# EAGLE board FSAE Dash v0.2 (EAGLE 7.7.0)
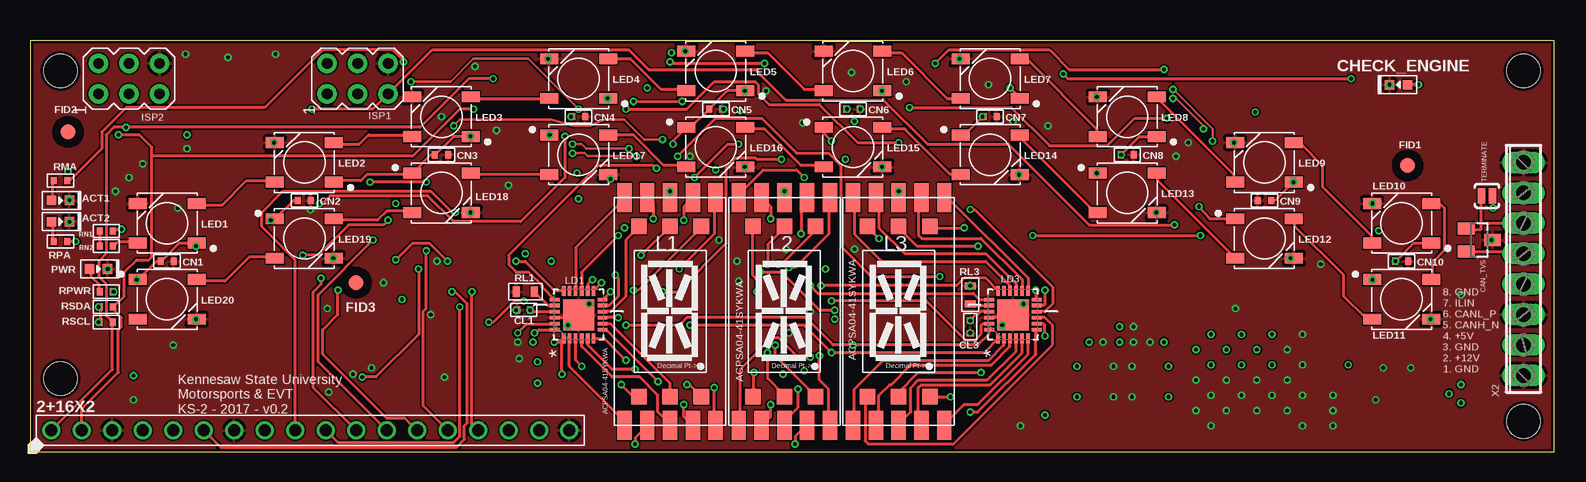
[diagram p5: board, top side]
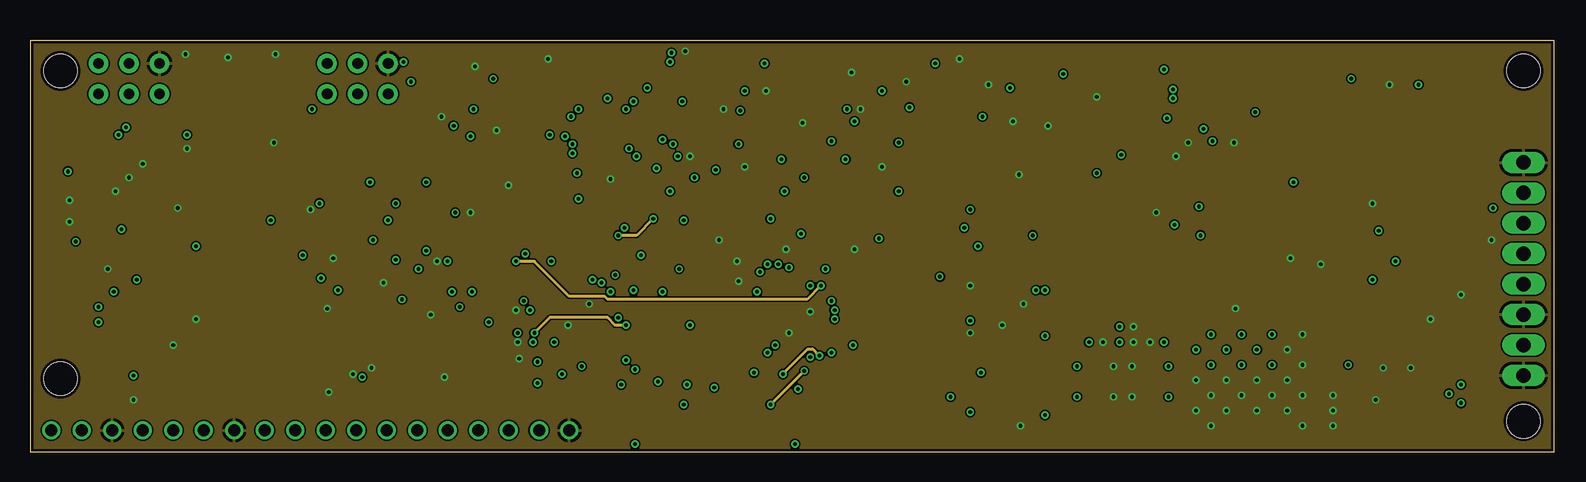
[diagram p6: board, inner layer Route2]
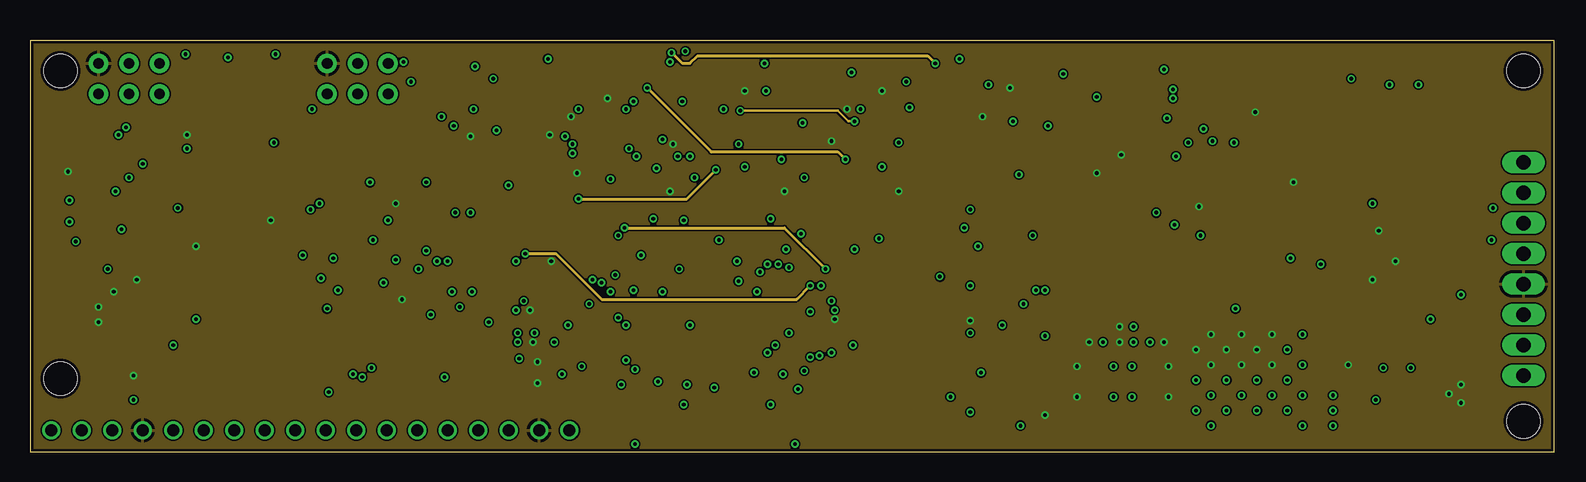
[diagram p7: board, inner layer Route15]
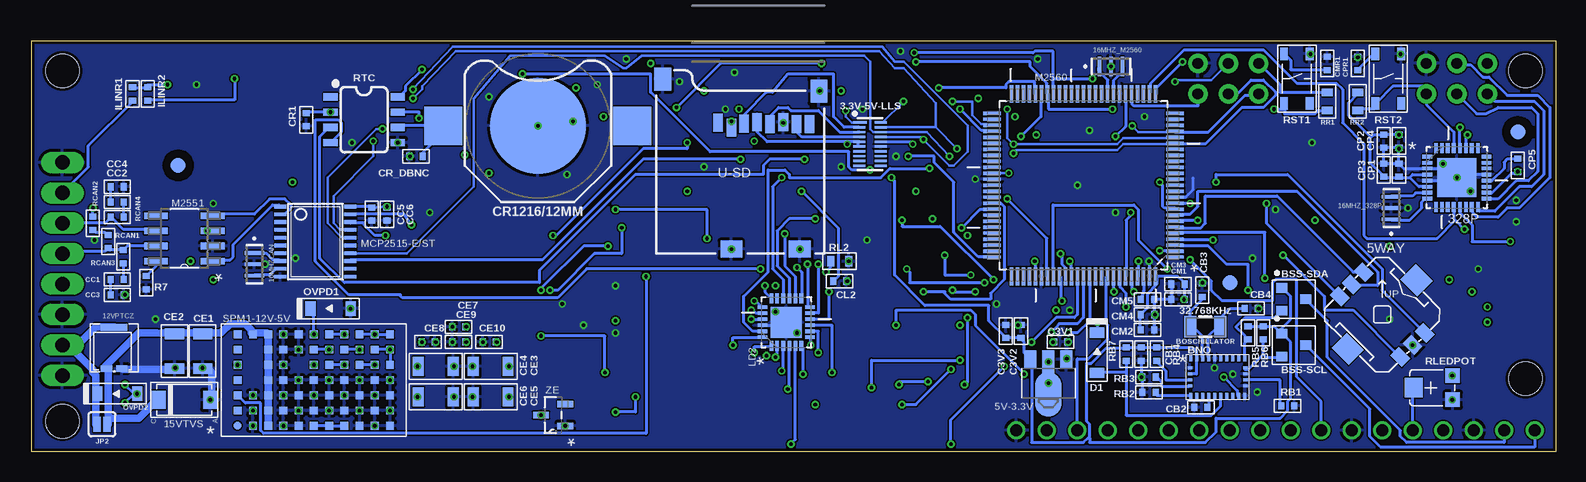
[diagram p8: board, bottom side, seen from below]

Size 127 x 34.29 mm. Coordinates in mm from the lower left corner, seen from the top.
Outline: 0,0 127,0 127,34.29 0,34.28 0,0
Copper layers (1*2*15*16): Top 0.035mm / dielectric 0.23mm / Route2 0.035mm / dielectric 0.93mm / Route15 0.035mm / dielectric 0.23mm / Bottom 0.035mm
Design rules "MF_Standard_4_Layer": minimum track width 5mil, minimum drill 12mil, track to track 5mil, track to pad 5mil, pad to pad 5mil, via to via 5mil, smd to smd 0mil, copper to edge 10mil, drill to drill 10mil, minimum pad ring 6mil, minimum via ring 6mil, stop-mask expansion 2mil, vias tented up to drill 25mil, thermal gap 10mil
Net classes: 0 default: width 0.254 mm, drill 0.305 mm, clearance 0.064 mm; 1 _12mil: width 0.305 mm, clearance 0.127 mm; 2 _25mil: width 0.635 mm, clearance 0.127 mm; 3 5mil: width 0.127 mm, clearance 0.127 mm; 4 10mil: width 0.254 mm, clearance 0.254 mm; 5 8mil: width 0.203 mm, drill 0.305 mm, clearance 0.064 mm
Holes 2.8 mm at 2.54,31.75 124.46,2.54 124.46,31.75 2.54,6.1

## Footprints (pad centres in the part's own frame; a part is rotated, then mirrored left to right if it is on the bottom)
PTH_2.54MM_01X18 = drill 1: P$1 -21.59,0; P$2 -19.05,0; P$3 -16.51,0; P$4 -13.97,0; P$5 -11.43,0; P$6 -8.89,0; P$7 -6.35,0; P$8 -3.81,0; P$9 -1.27,0; P$10 1.27,0; P$11 3.81,0; P$12 6.35,0; P$13 8.89,0; P$14 11.43,0; P$15 13.97,0; P$16 16.51,0; P$17 19.05,0; P$18 21.59,0
UFDFN-20 = smd 0.2 x 1.1: 1 -1.8,-0.85 | smd 0.2 x 1: 2 -1.4,-0.9; 3 -1,-0.9; 4 -0.6,-0.9; 5 -0.2,-0.9; 6 0.2,-0.9; 7 0.6,-0.9; 8 1,-0.9; 9 1.4,-0.9; 10 1.8,-0.9; 11 1.8,0.9; 12 1.4,0.9; 13 1,0.9; 14 0.6,0.9; 15 0.2,0.9; 16 -0.2,0.9; 17 -0.6,0.9; 18 -1,0.9; 19 -1.4,0.9; 20 -1.8,0.9
SOT89 = smd 1 x 1.5: 1 -1.499,-1.981; 3 1.499,-1.981 | smd 1 x 2: 2 0,-1.727 | smd 2.2 x 3.7: 2@1 0,0.94
ALPS-SKRHAAE010 = smd 1.35 x 1: P6D-D 3.575,-1.425; PA1-U -3.575,1.425; PB4-R 3.575,1.425; PC3-L -3.575,-1.425; PCEN2 -3.575,0; PCOM5 3.575,0 | smd 2 x 1.8: P7U 0,-4.05; P8U 0,4.05
LITTELFUSE-POLYZEN-ZEN164V130A24LS = smd 0.56 x 2.21: P1VIN -1.72,0 | smd 0.56 x 0.94: P2GND 1.72,0.635; P3VOUT 1.72,-0.635
LITTELFUSE-TPSMA6L15A = smd 1.2 x 1.52: PA 2.16,0; PC -2.16,0
OSC_CSTCE16M0V53-R0 = smd 0.3 x 1.6: 1 -0.95,0; 2 0,0; 3 0.95,0
QFN50P500X500X100-33N = smd 0.813 x 0.305: 1 -2.464,1.753; 2 -2.464,1.245; 3 -2.464,0.762; 4 -2.464,0.254; 5 -2.464,-0.254; 6 -2.464,-0.762; 7 -2.464,-1.245; 8 -2.464,-1.753; 17 2.464,-1.753; 18 2.464,-1.245; 19 2.464,-0.762; 20 2.464,-0.254; 21 2.464,0.254; 22 2.464,0.762; 23 2.464,1.245; 24 2.464,1.753 | smd 0.305 x 0.813: 9 -1.753,-2.464; 10 -1.245,-2.464; 11 -0.762,-2.464; 12 -0.254,-2.464; 13 0.254,-2.464; 14 0.762,-2.464; 15 1.245,-2.464; 16 1.753,-2.464; 25 1.753,2.464; 26 1.245,2.464; 27 0.762,2.464; 28 0.254,2.464; 29 -0.254,2.464; 30 -0.762,2.464; 31 -1.245,2.464; 32 -1.753,2.464 | smd 3.251 x 3.251: 33 0,0
LED0603 = smd 0.8 x 0.8: ANODE 0.75,0; CATHODE -0.75,0
BOSCH-BNO055 = smd 0.25 x 0.475: P1 -2.25,1.562; P6 -2.25,-1.562; P7 -1.75,-1.562; P8 -1.25,-1.562; P9 -0.75,-1.562; P10 -0.25,-1.562; P11 0.25,-1.562; P12 0.75,-1.562; P13 1.25,-1.562; P14 1.75,-1.562; P15 2.25,-1.562; P20 2.25,1.562; P21 1.75,1.562; P22 1.25,1.562; P23 0.75,1.562; P24 0.25,1.562; P25 -0.25,1.562; P26 -0.75,1.562; P27 -1.25,1.562; P28 -1.75,1.562 | smd 0.375 x 0.25: P2 -2.312,0.75; P3 -2.312,0.25; P4 -2.312,-0.25; P5 -2.312,-0.75; P16 2.312,-0.75; P17 2.312,-0.25; P18 2.312,0.25; P19 2.312,0.75
CRYSTAL-SMD-3.2X1.5MM = smd 1 x 1.8: P$1 -1.25,0; P$2 1.25,0
SOT-23-3 = smd 0.9 x 0.8: P$1 -1,0.95; P$2 -1,-0.95; P$3 1,0
C0402 = smd 0.5 x 0.6: P$1 -0.55,0; P$2 0.55,0
SOT23 = smd 1 x 1.4: 1 -0.95,-1.1; 2 0.95,-1.1; 3 0,1.1
C1206 = smd 0.9 x 1.6: P$1 -1.45,0; P$2 1.45,0
BATTCON_12MM = smd 8 x 8: GND 0,0 | smd 3.175 x 3.175: PWR@1 -7.874,0; PWR@2 7.874,0
SOD-123 = smd 0.85 x 1.2: ANODE 1.675,0; CATHODE -1.675,0
FIDUCIAL_100MIL = smd 1.27 x 1.27: P$1 0,0 | smd 1.27 x 1.27 bottom: P$2 0,0
R0402 = smd 0.5 x 0.6: P$1 -0.55,0; P$2 0.55,0
AVRISP = drill 0.9 pad 1.626: 1 -1.27,2.54; 2 1.27,2.54; 3 -1.27,0; 4 1.27,0; 5 -1.27,-2.54; 6 1.27,-2.54
SMT-JUMPER_2_NO_SILK = smd 0.635 x 1.27: 1 -0.406,0; 2 0.406,0
ACPSA04-41SYKWA = smd 1.2 x 2.4: P$1 -3.8,-9.5; P$2 -1.9,-9.5; P$3 0,-9.5; P$4 1.9,-9.5; P$5 3.8,-9.5; P$12 3.8,9.5; P$13 1.9,9.5; P$14 0,9.5; P$15 -1.9,9.5; P$16 -3.8,9.5 | smd 1.3 x 1.3: P$6 2.6,-7.1; P$7 0,-7.1; P$8 -2.6,-7.1; P$9 -2.6,7.1; P$10 0,7.1; P$11 2.6,7.1
QFN50P400X400X100-25N = smd 0.813 x 0.305: 1 -1.981,1.245; 2 -1.981,0.762; 3 -1.981,0.254; 4 -1.981,-0.254; 5 -1.981,-0.762; 6 -1.981,-1.245; 13 1.981,-1.245; 14 1.981,-0.762; 15 1.981,-0.254; 16 1.981,0.254; 17 1.981,0.762; 18 1.981,1.245 | smd 0.305 x 0.813: 7 -1.245,-1.981; 8 -0.762,-1.981; 9 -0.254,-1.981; 10 0.254,-1.981; 11 0.762,-1.981; 12 1.245,-1.981; 19 1.245,1.981; 20 0.762,1.981; 21 0.254,1.981; 22 -0.254,1.981; 23 -0.762,1.981; 24 -1.245,1.981 | smd 2.591 x 2.591: 25 -0.025,0
WS2812B = smd 1.5 x 0.9: P$1 -2.45,1.65; P$2 -2.45,-1.65; P$3 2.45,-1.65; P$4 2.45,1.65
TSSOP20 = smd 0.305 x 0.991: 1 -2.925,-2.918; 2 -2.275,-2.918; 3 -1.625,-2.918; 4 -0.975,-2.918; 5 -0.325,-2.918; 6 0.325,-2.918; 7 0.975,-2.918; 8 1.625,-2.918; 9 2.275,-2.918; 10 2.925,-2.918; 11 2.925,2.918; 12 2.275,2.918; 13 1.625,2.918; 14 0.975,2.918; 15 0.325,2.918; 16 -0.325,2.918; 17 -0.975,2.918; 18 -1.625,2.918; 19 -2.275,2.918; 20 -2.925,2.918
SOIC127P600X175-8N = smd 1.981 x 0.559: 1 -2.362,1.905; 2 -2.362,0.635; 3 -2.362,-0.635; 4 -2.362,-1.905; 5 2.362,-1.905; 6 2.362,-0.635; 7 2.362,0.635; 8 2.362,1.905
QFP50P1600X1600X120-100N = smd 1.473 x 0.279: 1 -7.62,5.994; 2 -7.62,5.512; 3 -7.62,5.004; 4 -7.62,4.496; 5 -7.62,3.988; 6 -7.62,3.505; 7 -7.62,2.997; 8 -7.62,2.489; 9 -7.62,2.007; 10 -7.62,1.499; 11 -7.62,0.991; 12 -7.62,0.508; 13 -7.62,0; 14 -7.62,-0.508; 15 -7.62,-0.991; 16 -7.62,-1.499; 17 -7.62,-2.007; 18 -7.62,-2.489; 19 -7.62,-2.997; 20 -7.62,-3.505; 21 -7.62,-3.988; 22 -7.62,-4.496; 23 -7.62,-5.004; 24 -7.62,-5.512; 25 -7.62,-5.994; 51 7.62,-5.994; 52 7.62,-5.512; 53 7.62,-5.004; 54 7.62,-4.496; 55 7.62,-3.988; 56 7.62,-3.505; 57 7.62,-2.997; 58 7.62,-2.489; 59 7.62,-2.007; 60 7.62,-1.499; 61 7.62,-0.991; 62 7.62,-0.508; 63 7.62,0; 64 7.62,0.508; 65 7.62,0.991; 66 7.62,1.499; 67 7.62,2.007; 68 7.62,2.489; 69 7.62,2.997; 70 7.62,3.505; 71 7.62,3.988; 72 7.62,4.496; 73 7.62,5.004; 74 7.62,5.512; 75 7.62,5.994 | smd 0.279 x 1.473: 26 -5.994,-7.62; 27 -5.512,-7.62; 28 -5.004,-7.62; 29 -4.496,-7.62; 30 -3.988,-7.62; 31 -3.505,-7.62; 32 -2.997,-7.62; 33 -2.489,-7.62; 34 -2.007,-7.62; 35 -1.499,-7.62; 36 -0.991,-7.62; 37 -0.508,-7.62; 38 0,-7.62; 39 0.508,-7.62; 40 0.991,-7.62; 41 1.499,-7.62; 42 2.007,-7.62; 43 2.489,-7.62; 44 2.997,-7.62; 45 3.505,-7.62; 46 3.988,-7.62; 47 4.496,-7.62; 48 5.004,-7.62; 49 5.512,-7.62; 50 5.994,-7.62; 76 5.994,7.62; 77 5.512,7.62; 78 5.004,7.62; 79 4.496,7.62; 80 3.988,7.62; 81 3.505,7.62; 82 2.997,7.62; 83 2.489,7.62; 84 2.007,7.62; 85 1.499,7.62; 86 0.991,7.62; 87 0.508,7.62; 88 0,7.62; 89 -0.508,7.62; 90 -0.991,7.62; 91 -1.499,7.62; 92 -2.007,7.62; 93 -2.489,7.62; 94 -2.997,7.62; 95 -3.505,7.62; 96 -3.988,7.62; 97 -4.496,7.62; 98 -5.004,7.62; 99 -5.512,7.62; 100 -5.994,7.62
R0603 = smd 0.6 x 0.9: P$1 -0.75,0; P$2 0.75,0
TC33 = smd 1.2 x 1.2: P$1 -1.8,1; P$3 -1.8,-1 | smd 1.5 x 1.6: P$2 1.45,0
TACT4.2MM = smd 1.05 x 0.65: P$1 -2.075,1.075; P$2 2.075,1.075; P$3 -2.075,-1.075; P$4 2.075,-1.075
SO08 = smd 0.6 x 1.2: 1 -1.905,-2.8; 2 -0.635,-2.8; 3 0.635,-2.8; 4 1.905,-2.8; 5 1.905,2.8; 6 0.635,2.8; 7 -0.635,2.8; 8 -1.905,2.8
SPM1004-5V0C = smd 0.65 x 0.65: AGND$1 -5.08,-1.27; AGND$2 -5.08,-2.54; AGND$3 -5.08,-3.81; EN -6.35,3.81; PGND$1 -2.54,3.81; PGND$2 -1.27,3.81; PGND$3 -2.54,2.54; PGND$4 -1.27,2.54; PGND$5 -2.54,1.27; PGND$6 -2.54,0; PGND$7 -1.27,0; PGND$8 0,0; PGND$9 1.27,0; PGND$10 2.54,0; PGND$11 3.81,0; PGND$12 5.08,0; PGND$13 6.35,0; PGND$14 -2.54,-1.27; PGND$15 -1.27,-1.27; PGND$16 0,-1.27; PGND$17 1.27,-1.27; PGND$18 2.54,-1.27; PGND$19 3.81,-1.27; PGND$20 5.08,-1.27; PGND$21 6.35,-1.27; PGND$22 -2.54,-2.54; PGND$23 -1.27,-2.54; PGND$24 0,-2.54; PGND$25 1.27,-2.54; PGND$26 2.54,-2.54; PGND$27 3.81,-2.54; PGND$28 5.08,-2.54; PGND$29 6.35,-2.54; PGND$30 -2.54,-3.81; PGND$31 -1.27,-3.81; PGND$32 3.81,-3.81; PGND$33 5.08,-3.81; PGND$34 6.35,-3.81; PHASE$1 0,-3.81; PHASE$2 1.27,-3.81; PHASE$3 2.54,-3.81; PVIN$1 -5.08,3.81; PVIN$2 -3.81,3.81; PVIN$3 -3.81,2.54; PVIN$4 -3.81,1.27; PVIN$5 -3.81,0; PVIN$6 -3.81,-1.27; PVIN$7 -3.81,-2.54; PVIN$8 -3.81,-3.81; PWRGD -6.35,-1.27; SS -6.35,0; VADJ -6.35,2.54; VAUX$1 -6.35,-2.54; VAUX$2 -6.35,-3.81; VOUT$1 0,3.81; VOUT$2 1.27,3.81; VOUT$3 2.54,3.81; VOUT$4 3.81,3.81; VOUT$5 5.08,3.81; VOUT$6 6.35,3.81; VOUT$7 0,2.54; VOUT$8 1.27,2.54; VOUT$9 2.54,2.54; VOUT$10 3.81,2.54; VOUT$11 5.08,2.54; VOUT$12 6.35,2.54; VOUT$13 0,1.27; VOUT$14 1.27,1.27; VOUT$15 2.54,1.27; VOUT$16 3.81,1.27; VOUT$17 5.08,1.27; VOUT$18 6.35,1.27; VSENSE -6.35,1.27
PAD-JUMPER-2-NO_YES_SILK = smd 0.635 x 1.27: 1 -0.45,0; 2 0.45,0
MICROSD_1:1 = smd 0.8 x 1.5: 1 5.096,10.919; 2 6.218,10.519; 3 7.274,10.853; 4 8.367,10.982; 5 9.421,10.828; 6 10.539,10.973; 7 11.648,10.819; 8 12.721,10.819 | smd 1.8 x 1.4: CD1 11.92,0.4; CD2 6.22,0.4 | smd 1.4 x 1.9: GND1 0.497,14.55; GND3 13.52,13.55
8POL254 = drill 1.2 long: 1 -8.89,0; 2 -6.35,0; 3 -3.81,0; 4 -1.27,0; 5 1.27,0; 6 3.81,0; 7 6.35,0; 8 8.89,0
SOT91P240X110-3N = smd 1.321 x 0.559: 1 -1.016,0.914; 2 -1.016,-0.914; 3 1.016,0

## Placement (x,y rotation side)
2+16X2  MF-CON-2.54mm-01x18  [PTH_2.54MM_01X18]  23.37,1.78 0 top
3.3V-5V-LLS  TXB0108DQSR  [UFDFN-20]  57.15,25.65 270 bottom
5V-3.3V  MCP1703T-3302E/MB  [SOT89]  42.29,5.71 180 bottom
5WAY  SKRHAAE010  [ALPS-SKRHAAE010]  14.48,11.43 315 bottom
12VPTCZ  ZEN164V130A24LS  [LITTELFUSE-POLYZEN-ZEN164V130A24LS]  120.14,8.64 270 bottom
15VTVS  TPSMA6L15A  [LITTELFUSE-TPSMA6L15A]  114.3,4.32 0 bottom
16MHZ_328P  CSTCE16M0VH3L99-R0  [OSC_CSTCE16M0V53-R0]  13.72,20.32 90 bottom
16MHZ_M2560  CSTCE16M0VH3L99-R0  [OSC_CSTCE16M0V53-R0]  37.08,32.13 0 bottom
16MHZCAN  CSTCE16M0VH3L99-R0  [OSC_CSTCE16M0V53-R0]  108.46,15.62 270 bottom
328P  ATMEGA328P-MU  [QFN50P500X500X100-33N]  8.26,22.86 0 bottom
ACT1  MF-LED-0603-RED  [LED0603]  2.54,20.95 180 top
ACT2  MF-LED-0603-RED  [LED0603]  2.54,19.18 180 top
BNO  BNO055  [BOSCH-BNO055]  28.19,6.22 0 bottom
BOSCHILLATOR  32.768KHz  [CRYSTAL-SMD-3.2X1.5MM]  29.21,10.41 180 bottom
BSS-SCL  MF-DSC-SOT233-BSS138  [SOT-23-3]  21.84,8.89 0 bottom
BSS-SDA  MF-DSC-SOT233-BSS138  [SOT-23-3]  21.84,12.7 0 bottom
C3V1  1uF  [C0402]  41.27,9.14 180 bottom
C3V2  0.1uF  [C0402]  44.58,10.03 270 bottom
C3V3  1uF  [C0402]  45.85,10.03 270 bottom
CAN_TVS  PESD1CAN,215  [SOT23]  120.78,17.65 270 top
CB1  0.1uF  [C0402]  34.54,8.13 270 bottom
CB2  0.1uF  [C0402]  29.59,3.68 180 bottom
CB3  22pf  [C0402]  29.46,13.46 90 bottom
CB4  22pf  [C0402]  25.4,11.94 0 bottom
CC1  0.001uF  [C0402]  119.89,14.35 180 bottom
CC2  0.001uF  [C0402]  119.89,20.83 180 bottom
CC3  0.001uF  [C0402]  119.89,13.08 0 bottom
CC4  0.001uF  [C0402]  119.89,22.1 0 bottom
CC5  0.1uF  [C0402]  98.68,19.81 270 bottom
CC6  0.1uF  [C0402]  97.41,19.81 90 bottom
CE1  C3216X5R1E476M160AC  [C1206]  112.78,8.38 270 bottom
CE2  C3216X5R1E476M160AC  [C1206]  115.11,8.38 270 bottom
CE3  C3216X5R1E476M160AC  [C1206]  88.77,7.11 0 bottom
CE4  C3216X5R1E476M160AC  [C1206]  93.34,7.11 180 bottom
CE5  C3216X5R1E476M160AC  [C1206]  88.77,4.57 0 bottom
CE6  C3216X5R1E476M160AC  [C1206]  93.34,4.57 180 bottom
CE7  0.1uF  [C0402]  91.44,10.41 0 bottom
CE8  1uF  [C0402]  93.98,9.14 0 bottom
CE9  1uF  [C0402]  91.44,9.14 180 bottom
CE10  4.7uF  [C0402]  88.9,9.14 180 bottom
CHECK_ENGINE  MF-LED-0603-RED  [LED0603]  114.05,30.61 0 top
CL1  0.1uF  [C0402]  41.15,11.81 0 top
CL2  0.1uF  [C0402]  59.69,14.22 180 bottom
CL3  0.1uF  [C0402]  78.36,10.41 90 top
CM1  1uF  [C0402]  31.5,12.7 180 bottom
CM2  0.1uF  [C0402]  34.04,10.16 0 bottom
CM3  4.7uF  [C0402]  31.5,13.97 180 bottom
CM4  0.001uF  [C0402]  34.04,11.43 0 bottom
CM5  0.1uF  [C0402]  34.04,12.7 180 bottom
CMR1  1uF  [C0402]  19.05,32.38 270 bottom
CN1  0.1uF  [C0402]  11.43,15.88 0 top
CN2  0.1uF  [C0402]  22.86,20.95 0 top
CN3  0.1uF  [C0402]  34.29,24.77 0 top
CN4  0.1uF  [C0402]  45.72,27.94 0 top
CN5  0.1uF  [C0402]  57.15,28.57 0 top
CN6  0.1uF  [C0402]  68.58,28.57 0 top
CN7  0.1uF  [C0402]  80.01,27.94 0 top
CN8  0.1uF  [C0402]  91.44,24.77 0 top
CN9  0.1uF  [C0402]  102.87,20.95 180 top
CN10  0.1uF  [C0402]  114.3,15.88 0 top
CP1  0.001uF  [C0402]  13.08,23.5 270 bottom
CP2  4.7uF  [C0402]  14.35,25.91 90 bottom
CP3  0.1uF  [C0402]  14.35,23.5 270 bottom
CP4  1uF  [C0402]  13.08,25.91 270 bottom
CP5  0.1uF  [C0402]  3.17,23.88 90 bottom
CPR1  1uF  [C0402]  16.51,32.38 270 bottom
CR1  1uF  [C0402]  104.14,27.69 270 bottom
CR1216/12MM  3000TR  [BATTCON_12MM]  84.84,27.18 0 bottom
CR_DBNC  0.001uF  [C0402]  95,24.64 180 bottom
D1  MF-DIO-SOD123-1N4148  [SOD-123]  38.23,8.26 270 bottom
FID1  [FIDUCIAL_100MIL]  114.81,23.88 0 top
FID2  [FIDUCIAL_100MIL]  3.17,26.67 180 top
FID3  [FIDUCIAL_100MIL]  27.18,14.1 0 top
ILINR1  220  [R0402]  118.62,29.84 90 bottom
ILINR2  220  [R0402]  117.35,29.84 270 bottom
ISP1  AVRISP-6  [AVRISP]  27.3,31.11 90 top
ISP2  AVRISP-6  [AVRISP]  8.26,31.11 90 top
JP2  JUMPER-SMT_2_NO_SILK  [SMT-JUMPER_2_NO_SILK]  121.16,2.29 0 bottom
L1  ACPSA04-41SYKWA  [ACPSA04-41SYKWA]  53.34,11.68 0 top
L2  ACPSA04-41SYKWA  [ACPSA04-41SYKWA]  62.87,11.68 0 top
L3  ACPSA04-41SYKWA  [ACPSA04-41SYKWA]  72.39,11.68 0 top
LD1  TLC59281RGER  [QFN50P400X400X100-25N]  45.72,11.43 90 top
LD2  TLC59281RGER  [QFN50P400X400X100-25N]  64.14,10.79 90 bottom
LD3  TLC59281RGER  [QFN50P400X400X100-25N]  81.92,11.43 90 top
LED1  WS2812B  [WS2812B]  11.43,19.05 180 top
LED2  WS2812B  [WS2812B]  22.86,24.13 180 top
LED3  WS2812B  [WS2812B]  34.29,27.94 180 top
LED4  WS2812B  [WS2812B]  45.72,31.11 180 top
LED5  WS2812B  [WS2812B]  57.15,31.75 180 top
LED6  WS2812B  [WS2812B]  68.58,31.75 180 top
LED7  WS2812B  [WS2812B]  80.01,31.11 180 top
LED8  WS2812B  [WS2812B]  91.44,27.94 180 top
LED9  WS2812B  [WS2812B]  102.87,24.13 180 top
LED10  WS2812B  [WS2812B]  114.3,19.05 180 top
LED11  WS2812B  [WS2812B]  114.3,12.7 0 top
LED12  WS2812B  [WS2812B]  102.87,17.78 0 top
LED13  WS2812B  [WS2812B]  91.44,21.59 0 top
LED14  WS2812B  [WS2812B]  80.01,24.77 0 top
LED15  WS2812B  [WS2812B]  68.58,25.4 0 top
LED16  WS2812B  [WS2812B]  57.15,25.4 0 top
LED17  WS2812B  [WS2812B]  45.72,24.77 0 top
LED18  WS2812B  [WS2812B]  34.29,21.59 0 top
LED19  WS2812B  [WS2812B]  22.86,17.78 0 top
LED20  WS2812B  [WS2812B]  11.43,12.7 0 top
M2515  MCP2515-E/ST  [TSSOP20]  103.38,17.53 270 bottom
M2551  MCP2551-I/SN  [SOIC127P600X175-8N]  114.3,17.78 180 bottom
M2560  ATMEGA2560-16AU  [QFP50P1600X1600X120-100N]  39.37,22.23 180 bottom
OVPD1  PMEG3010ER,115  [SOD-123]  102.11,11.94 0 bottom
OVPD2  PMEG3010ER,115  [SOD-123]  119.89,4.83 0 bottom
PWR  MF-LED-0603-GREEN  [LED0603]  5.71,15.24 180 top
R7  4.7K  [R0402]  117.47,14.1 270 bottom
RB1  10K  [R0402]  22.35,3.81 180 bottom
RB2  10K  [R0402]  33.91,4.95 180 bottom
RB3  10K  [R0402]  33.91,6.22 180 bottom
RB4  10K  [R0402]  33.27,8.13 270 bottom
RB5  10K  [R0402]  25.65,9.91 90 bottom
RB6  10K  [R0402]  24.38,9.91 90 bottom
RB7  10K  [R0402]  35.81,8.13 90 bottom
RCAN1  60.4  [R0402]  120.65,17.53 90 bottom
RCAN2  60.4  [R0402]  121.92,19.05 90 bottom
RCAN3  100  [R0402]  119.38,16.26 270 bottom
RCAN4  100  [R0402]  119.89,19.56 0 bottom
RL1  1.69K  [R0603]  41.27,13.34 0 top
RL2  1.69K  [R0603]  59.69,15.88 180 bottom
RL3  1.69K  [R0603]  78.36,13.08 270 top
RLEDPOT  MF-RES-TC33X-10K  [TC33]  10.41,5.33 180 bottom
RMA  220  [R0402]  2.54,22.61 0 top
RN1  220  [R0402]  6.35,18.41 0 top
RN2  220  [R0402]  6.35,17.14 0 top
RPA  220  [R0402]  2.54,17.53 180 top
RPWR  220  [R0402]  6.35,13.34 0 top
RR1  4.7K  [R0603]  19.05,29.21 270 bottom
RR2  4.7K  [R0603]  16.51,29.21 270 bottom
RSCL  4.7K  [R0402]  6.35,10.79 180 top
RSDA  4.7K  [R0402]  6.35,12.06 180 top
RST1  MF-SW-TACT-4.2MM  [TACT4.2MM]  21.59,31.11 270 bottom
RST2  MF-SW-TACT-4.2MM  [TACT4.2MM]  13.97,31.11 270 bottom
RTC  DS3231MZ/V+  [SO08]  99.31,27.69 270 bottom
SPM1-12V-5V  SPM1004-5V0C  [SPM1004-5V0C]  103.5,5.97 0 bottom
TERMINATE  JUMPER-PAD-2-NOYES_SILK  [PAD-JUMPER-2-NO_YES_SILK]  121.41,21.34 0 top
U-SD  MF-MICROSD  [MICROSD_1:1]  74.93,16.51 0 bottom
X2  MPT8  [8POL254]  124.46,15.24 90 top
ZE  BZX84-A5V6,215  [SOT91P240X110-3N]  83.57,3.05 180 bottom

## Tracks (layer width: path | path; a pad name or v marks a point on that pad's centre or on a via)
+3.3V  (via drill 0.3)
  Top 0.254: v59.05,25.65 58.17,25.65 v55.37,22.86
  Bottom 0.254: RB5.P$2 RB6.P$2 23.46,10.46 BSS-SCL.P$1 | 66.56,28.18 U-SD.4 66.55,27.48 66.55,26.67 65.73,25.85 59.05,25.85 | 59.05,25.85 3.3V-5V-LLS.5 58.17,25.78 58.17,25.53 3.3V-5V-LLS.6 | 45.85,9.53 44.58,9.53 C3V2.P$2 44.58,9.4 44.32,9.14 44.32,8.26 43.81,7.75 5V-3.3V.3 43.69,7.62 43.69,0.76 39.37,0.76 38.92,1.21 | v59.05,25.65 59.05,25.85 | v55.37,22.86 55.12,22.61 55.12,14.73 52.58,12.19 47.24,12.19 47.24,10.92 45.85,9.53 | 45.85,9.53 C3V3.P$2 | BSS-SDA.P$1 22.73,13.59 22.1,12.95 22.1,11.05 22.99,10.16 BSS-SCL.P$1 | BNO.P3 30.48,6.48 29.97,6.48 29.97,7.75 BNO.P28 29.97,7.81 29.97,8.38 30.27,8.68 RB4.P$1 CB1.P$1 RB7.P$2 35.81,8.64 37.47,8.64 38.73,7.37 39.12,7.37 39.12,2.54 38.86,2.29 38.86,1.27 38.92,1.21 | BSS-SCL.P$1 22.73,9.78 22.1,9.14 22.1,4.45 22.35,4.19 22.35,3.43 22.99,2.79 28.32,2.79 28.32,1.65 29.21,0.76 38.86,0.76 38.86,1.14 38.92,1.21
+5V  (via drill 0.3)
  Top 0.254: LD3.21 79.25,11.68 78.99,11.43 78.83,11.43 CL3.P$2 v78.36,10.92 | L3.P$14 v72.39,21.72 | L2.P$14 v62.87,21.72 | L1.P$14 v53.34,21.72 | v53.59,25.65 53.59,25.94 LED16.P$1 55.08,27.05 CN5.P$1 58.12,30.1 v59.56,30.1 LED5.P$1 | LED2.P$1 25.4,22.61 27.56,22.61 28.07,23.11 31.75,23.11 LED18.P$1 31.88,23.24 33.4,24.77 CN3.P$1 33.78,24.77 35.31,26.29 v36.7,26.29 LED3.P$1 | RSCL.P$2 v5.71,10.79 5.84,10.79 5.84,12.06 RSDA.P$2 | v6.99,13.34 RPWR.P$2 | 9.02,14.35 10.54,15.88 CN1.P$1 10.92,15.88 12.45,17.4 13.84,17.4 LED1.P$1 | CL1.P$2 v41.66,11.81 41.78,11.81 41.91,11.68 LD1.21 | v45.09,27.94 CN4.P$1 | v68.07,28.57 CN6.P$1 | CN7.P$1 v79.38,27.94 77.85,26.42 77.6,26.42 LED14.P$1 | CN8.P$1 v90.93,24.77 92.46,26.29 93.85,26.29 LED8.P$1 | CN9.P$1 103.76,20.95 v105.28,22.48 LED9.P$1 | CN10.P$1 v113.79,15.88 115.32,17.4 116.71,17.4 LED10.P$1 | 9.02,14.35 LED20.P$1 | 9.02,14.35 v8.89,14.35 | v43.31,26.42 LED17.P$1 | v48.13,29.46 LED4.P$1 | v66.8,25.91 66.17,26.54 66.17,26.92 LED15.P$1 | v70.99,30.1 LED6.P$1 | v81.66,30.35 82.42,29.59 LED7.P$1 | v88.9,23.24 LED13.P$1 | v97.41,20.45 98.3,19.43 100.33,19.43 LED12.P$1 | v111.89,14.35 LED11.P$1 | 22.35,20.95 CN2.P$1 21.97,20.95 20.45,19.43 LED19.P$1 20.28,19.3 v20.07,19.3
  Bottom 0.254: 15.43,26.23 15.24,26.42 14.48,26.42 CP2.P$2 CP4.P$1 v13.08,26.42 | 15.43,26.23 15.49,26.16 15.49,24.13 14.48,23.11 CP3.P$2 14.22,22.86 13.21,22.86 CP1.P$2 12.95,22.86 12.19,22.86 | 328P.4 11.94,23.11 12.19,22.86 | 328P.6 11.43,22.1 12.19,22.86 | OVPD2.ANODE 118.49,4.83 | 118.49,4.83 v119.25,5.59 | 118.49,4.83 v119.25,4.06 | M2560.31 35.87,27.13 v36.7,26.29 | M2551.3 v112.39,18.41 | 328P.18 5.59,21.59 5.33,21.59 3.68,23.24 3.3,23.24 v3.17,23.37 CP5.P$1 | M2560.80 43.36,15.8 v43.43,15.88 | v45.59,23.24 M2560.61 | 3.3V-5V-LLS.16 53.79,25.85 v53.59,25.65 | 15.43,26.23 17.27,28.07 17.27,29.08 16.51,29.84 RR2.P$1 | CM2.P$1 34.67,10.16 34.67,11.43 CM4.P$1 34.04,11.98 34.04,13.08 33.25,13.99 33.25,14.48 M2560.100 31.5,14.61 30.99,14.1 30.99,13.97 CM3.P$1 CM1.P$1 v30.99,12.7 | v41.91,9.14 C3V1.P$2 | v62.87,21.72 59.82,18.67 59.82,14.61 60.2,14.22 CL2.P$2 | v88.27,9.14 CE10.P$1 | v90.81,9.14 CE9.P$1 | v90.81,10.41 CE7.P$2 | v94.49,9.14 CE8.P$1 | CC6.P$2 v97.41,20.45 98.68,20.32 CC5.P$1 98.68,20.45 M2515.20 | CR1.P$1 104.14,28.32 RTC.2 | SPM1-12V-5V.VOUT$18 SPM1-12V-5V.VOUT$12 SPM1-12V-5V.VOUT$11 | SPM1-12V-5V.VOUT$17 SPM1-12V-5V.VOUT$16 | SPM1-12V-5V.VOUT$6 SPM1-12V-5V.VOUT$5 SPM1-12V-5V.VOUT$4 | SPM1-12V-5V.VOUT$10 SPM1-12V-5V.VOUT$9 | v100.97,7.24 SPM1-12V-5V.VOUT$14 | SPM1-12V-5V.VOUT$8 SPM1-12V-5V.VOUT$7 | v100.97,9.78 SPM1-12V-5V.VOUT$2 | v67.06,11.05 LD2.21 | ISP1.2 22.99,30.61 22.99,29.97 19.05,29.97 RR1.P$1 | v8.64,6.35 RLEDPOT.P$3 | SPM1-12V-5V.VOUT$1 103.5,11.68 103.76,11.94 OVPD1.CATHODE | v30.48,20.7 31.75,20.7 M2560.10 | v87.25,4.57 CE5.P$2 | v87.25,7.11 CE3.P$2 | v94.87,4.57 CE6.P$2
  Bottom 0.254: v94.87,7.11 CE4.P$2 | v42.29,7.49 5V-3.3V.2 | v42.29,5.71 5V-3.3V.2@1
  other vias: 109.86,7.24 102.11,28.32 98.42,9.78 97.16,8.51 99.69,8.51 98.42,7.24 102.23,8.51 103.5,9.78 103.5,7.24 84.58,3.05 118.24,4.83 5.71,12.06 13.84,17.14
  pour Route15: 0,34.29 127,34.29 127,0 0,0
+12V
  Bottom 0.635: 120.65,2.79 120.65,6.86 12VPTCZ.P3VOUT 120.9,7.11 118.11,9.91 116.59,9.91 CE2.P$1 116.08,9.91 112.78,9.91 | 120.65,2.79 120.65,2.29 JP2.2 | 120.65,2.79 118.11,2.79 116.59,4.32 15VTVS.PC | 112.78,9.91 111.25,9.91 110.49,10.67 109.22,10.67 108.71,10.16 108.71,9.91 SPM1-12V-5V.PVIN$1 108.46,9.91 107.44,9.91 SPM1-12V-5V.PVIN$2 SPM1-12V-5V.PVIN$3 SPM1-12V-5V.PVIN$4 SPM1-12V-5V.PVIN$5 SPM1-12V-5V.PVIN$6 SPM1-12V-5V.PVIN$7 SPM1-12V-5V.PVIN$8 | 112.78,9.91 CE1.P$1
+12VIN
  Bottom 0.635: JP2.1 121.67,2.29 121.67,4.83 OVPD2.CATHODE 121.67,5.08 121.67,6.35 121.92,6.6 121.92,6.86 123.95,8.89 X2.2 123.44,8.64 121.67,10.41 120.14,10.41 12VPTCZ.P1VIN
AREF
  Bottom 0.254: 328P.20 5.33,22.61 4.32,23.62 4.32,24.13 4.06,24.38 3.3,24.38 CP5.P$2
B_IMU-RST-5V  (via drill 0.3)
  Top 0.254: v38.23,10.79 38.61,10.79 40.39,12.57 v41.15,12.57
  Bottom 0.254: v38.23,10.79 D1.CATHODE | v41.15,12.57 41.27,12.7 41.27,14.61 M2560.84
B_INT-3.3V  (via drill 0.3)
  Top 0.254: v27.69,6.22 28.83,6.22 32.38,9.78 v32.38,15.24
  Bottom 0.254: v27.69,6.22 26.54,5.08 26.54,4.7 BNO.P14 | v32.38,15.24 34.8,17.65 34.8,20.19 35.18,20.57 41.91,20.57 41.91,14.61 M2560.83
BCAP
  Bottom 0.254: BNO.P9 28.94,3.78 CB2.P$1
CAN_CS  (via drill 0.3)
  Top 0.254: v83.57,18.03 v97.54,18.03 | v72.39,25.78 68.96,25.78 65.79,28.96 61.59,28.96 60.71,29.84 60.71,30.61 60.45,30.86 57.02,30.86 54.74,28.57 v49.66,28.57
  Bottom 0.254: v97.54,18.03 98.42,18.03 99.31,18.92 99.31,19.05 100.46,19.05 M2515.18 | v83.57,18.03 83.31,18.03 76.07,25.27 72.39,25.27 v72.39,25.78 | v49.66,28.57 47.88,26.8 46.99,26.8 M2560.54
CAN_INT  (via drill 0.3)
  Route15 0.254: v67.94,24.38 67.31,25.02 56.77,25.02 v51.44,30.35
  Bottom 0.254: v67.94,24.38 76.07,24.38 84.45,16 100.46,16 M2515.13 | v51.44,30.35 45.85,30.35 45.85,30.61 45.59,30.86 43.43,30.86 43.43,29.84 M2560.46
CAN_RXD
  Bottom 0.254: M2515.2 106.17,19.81 105.92,19.81 105.41,20.32 105.41,20.57 105.92,21.08 107.19,21.08 108.46,19.81 111.76,19.81 M2551.4
CAN_TXD
  Bottom 0.254: M2515.1 106.43,20.57 106.93,20.57 110.24,17.27 110.24,16.26 110.49,16 111.76,16 M2551.1
CANH_N
  Top 0.254: CAN_TVS.2 124.27,16.7 X2.5
  Bottom 0.254: X2.5 124.27,16.7 120.9,16.7 120.65,16.96 RCAN1.P$1 120.48,16.81 RCAN3.P$1 119.04,17.14 M2551.7
CANL_P
  Top 0.254: 120.9,19.05 X2.6 | CAN_TVS.1 119.89,18.54 120.9,18.54 120.9,19.05 | 120.9,19.05 120.9,21.34 TERMINATE.1
  Bottom 0.254: 120.4,19.56 RCAN4.P$1 | M2551.6 116.84,18.54 119.38,18.54 120.4,19.56 | 120.4,19.56 120.9,19.05 X2.6
DIN_R
  Top 0.254: LED1.P$4 8.89,17.53 7.37,17.53 7.11,17.27 RN2.P$2
GND  (via drill 0.3)
  Top 0.254: LD3.22 81.28,11.18 81.53,11.43 81.92,11.43 | LD1.22 44.58,11.18 44.83,11.43 45.72,11.43 LD1.25 | 81.92,11.43 82.8,11.43 v82.8,12.32 | 81.92,11.43 LD3.25
  Bottom 0.254: CM3.P$2 32,13.97 32,12.7 CM1.P$2 CM5.P$1 CM4.P$2 | CM4.P$2 v33.4,11.43 | CM4.P$2 CM2.P$2 | CB1.P$2 v34.54,6.22 RB3.P$2 RB2.P$2 | CB3.P$2 v29.46,14.1 | M2560.99 33.86,15.82 v33.91,15.88 | CP4.P$2 CP2.P$1 CP3.P$1 CP1.P$1 | CP1.P$1 v13.08,25.27 | CP1.P$1 13.08,24 12.7,23.62 328P.3 9.78,23.62 v9.4,24 | 328P.5 8.51,22.61 328P.33 8,23.11 328P.21 | v63.25,9.91 63.25,10.79 64.14,10.79 LD2.25 | M2560.11 30.84,21.23 30.23,21.84 30.23,22.86 | LD2.22 65.15,10.54 64.77,10.92 64.77,11.43 v65.02,11.68
  Bottom 0.635: 112.78,6.86 112.27,6.86 112.01,6.6 112.01,4.32 15VTVS.PA | 12VPTCZ.P2GND 119.38,6.86 114.81,6.86 CE2.P$2
  other vias: 11.94,8.89 40.77,7.75 44.83,10.54 46.61,12.32 81.03,10.54 78.36,13.84 78.36,9.91 91.82,7.11 90.3,7.11 90.3,4.57 91.82,4.57 82.55,2.16 100.46,11.94 106.05,9.78 112.14,4.32 112.78,6.99 115.06,6.99 116.71,11.05 111.89,20.7 84.84,27.18 88.9,29.59 77.47,32.77 82.42,23.11 70.99,23.75 64.39,27.43 61.34,30.1 59.56,23.75 57.78,28.57 54.61,33.4 48.39,22.73 36.7,19.94 20.32,25.78 12.95,33.15 20.45,33.15 37.08,32.13 43.18,32.77 100.33,25.78 96.52,25.78 95.5,24.64 93.85,19.94 25.27,16.13 13.84,11.05 8.64,4.32 6.48,15.24 3.3,19.18 3.3,20.95 7.11,21.72 8.26,22.86 16.51,32.89 26.92,6.48 28.45,6.99 12.32,20.32 40.51,11.81 40.64,9.14 58.93,15.88 59.05,14.22 62.99,16.89 68.71,16.89 106.05,7.24 106.05,4.7 106.05,2.16 104.78,3.43 103.5,4.7 102.23,5.97 100.97,4.7 99.69,3.43 98.42,2.16 97.16,3.43 98.42,4.7 99.69,5.97 97.16,5.97 102.23,3.43 104.78,5.97 104.78,8.51 108.58,4.7 108.58,3.43 108.58,2.16 89.41,9.14 91.95,9.14 91.95,10.41 93.34,9.14 119.25,13.08 121.79,17.65 113.28,30.61 105.03,16.13 107.57,15.62 57.4,17.65 69.22,28.57 24.77,11.94 23.37,20.19 54.99,24.64 38.86,26.8 39.88,22.23 24.89,4.95 68.45,31.62 79.88,30.61 81.92,27.56 73.03,30.86 34.29,27.94
  pour Route2: 0,34.29 127,34.29 127,0 0,0
  pour Bottom: 0,34.29 127,34.29 127,0 0,0
  pour Top: 0,34.29 127,34.29 127,0 0,0
  pour Bottom (rank 2): 97.03,2.03 99.82,2.03 99.82,3.3 104.65,3.3 104.65,2.03 106.17,2.03 106.17,9.91 104.65,9.91 104.65,6.1 97.03,6.1
HV_SD_CS  (via drill 0.3)
  Top 0.203: v50.29,29.21 v54.36,29.21
  Bottom 0.203: v54.36,29.21 56.13,27.43 3.3V-5V-LLS.20 | v50.29,29.21 48.64,29.21 48.64,28.07 47.88,27.3 46.99,27.3 M2560.53
I2CADDR_3V
  Bottom 0.254: BNO.P17 25.78,5.97 22.99,5.97 22.99,3.81 RB1.P$2
ILIN
  Bottom 0.254: X2.7 122.3,23.75 122.3,25.53 118.62,29.21 ILINR1.P$1
ILINR2N  (via drill 0.3)
  Top 0.254: v110.11,31.11 86.49,31.11 v86.11,31.5
  Route15 0.254: v57.15,23.5 54.74,21.08 v45.72,21.08
  Bottom 0.254: v110.11,31.11 110.11,29.34 117.35,29.34 ILINR2.P$2 | v86.11,31.5 75.44,31.5 75.44,29.97 70.48,25.02 58.93,25.02 58.93,23.75 58.67,23.5 v57.15,23.5 | v45.72,21.08 42.42,17.78 42.42,14.61 M2560.82
J_CENTER
  Bottom 0.254: 5WAY.PCEN2 16.89,13.84 14.86,13.84 14.86,14.99 21.59,21.72 29.84,21.72 29.84,20.45 30.48,19.81 31.75,19.81 M2560.8
J_DOWN  (via drill 0.3)
  Top 0.254: v22.73,16.38 24,16.38 26.54,18.92 29.46,18.92 v29.84,19.3
  Bottom 0.254: v22.73,16.38 19.3,12.95 19.3,11.81 16.89,11.81 13.08,8 5WAY.P6D-D | v29.84,19.3 31.75,19.3 M2560.7
J_LEFT  (via drill 0.3)
  Top 0.254: v24.13,20.7 24.38,20.7 25.02,21.34 33.15,21.34 35.31,19.18 40.89,19.18 44.58,22.86 v44.58,26.29
  Bottom 0.254: v24.13,20.7 24.13,19.05 18.03,12.95 5WAY.PC3-L | v44.58,26.29 42.93,27.94 42.93,29.84 M2560.45
J_RIGHT  (via drill 0.3)
  Top 0.254: v33.02,22.48 v28.32,22.48
  Bottom 0.254: v28.32,22.48 28.32,23.11 22.35,23.11 14.48,15.24 14.48,13.46 11.05,10.03 5WAY.PB4-R | v33.02,22.48 32.77,22.23 32.77,20.45 32.64,20.32 31.75,20.32 M2560.9
J_UP
  Bottom 0.254: 5WAY.PA1-U 16,14.99 16.89,14.99 23.24,21.34 29.21,21.34 29.21,19.05 29.59,18.67 31.75,18.67 M2560.6
L_DB0  (via drill 0.3)
  Top 0.254: v35.43,19.94 35.18,19.94 33.4,21.72 21.08,21.72 19.3,19.94 19.3,18.8 22.1,16 2+16X2.P$9
  Bottom 0.254: v35.43,19.94 35.43,19.68 35.81,19.3 35.81,14.61 M2560.95
L_DB1  (via drill 0.3)
  Top 0.254: v35.81,12.06 35.81,1.27 35.31,0.76 25.65,0.76 2+16X2.P$10
  Bottom 0.254: v35.81,12.06 35.81,13.21 36.32,13.72 36.32,14.61 M2560.94
L_DB2  (via drill 0.3)
  Top 0.254: v24.26,14.48 24.26,13.97 23.62,13.34 23.62,5.33 2+16X2.P$11
  Bottom 0.254: v24.26,14.48 24.26,18.29 31.75,18.29 M2560.5
L_DB3  (via drill 0.3)
  Top 0.254: v28.57,17.65 24,13.08 24,7.49 2+16X2.P$12
  Bottom 0.254: v28.57,17.65 31.75,17.65 M2560.4
L_DB4  (via drill 0.3)
  Top 0.254: v25.65,13.46 25.65,11.43 24.38,10.16 24.38,8.13 29.72,2.79 31.24,2.79 2+16X2.P$13
  Bottom 0.254: v25.65,13.46 25.65,15.62 27.43,15.62 28.96,17.14 31.75,17.14 M2560.3
L_DB5  (via drill 0.3)
  Top 0.254: v33.02,16.76 33.02,11.94 32.77,11.68 32.77,3.81 2+16X2.P$14
  Bottom 0.254: v33.02,16.76 31.75,16.76 M2560.2
L_DB6  (via drill 0.3)
  Top 0.254: v36.83,13.34 36.83,2.29 2+16X2.P$15
  Bottom 0.254: v36.83,13.34 36.83,14.61 M2560.93
L_DB7
  Bottom 0.254: 2+16X2.P$16 39.88,7.75 38.99,7.75 37.34,9.4 37.34,10.54 37.47,10.67 37.47,14.61 M2560.92
L_EN  (via drill 0.3)
  Top 0.254: v34.8,15.88 33.27,17.4 31.88,17.4 v30.48,16
  Bottom 0.254: v34.8,15.88 34.8,14.61 M2560.97 | v30.48,16 28.7,14.22 28.7,13.46 27.81,12.57 23.62,12.57 23.62,14.1 23.37,14.35 21.59,14.35 21.59,6.22 19.56,4.19 2+16X2.P$8
L_RS  (via drill 0.3)
  Top 0.254: v35.18,13.34 35.43,13.34 36.45,12.32 36.45,2.41 36.2,2.16 36.2,1.02 35.56,0.38 15.88,0.38 2+16X2.P$6
  Bottom 0.254: v35.18,13.34 35.31,13.46 35.31,14.61 M2560.96
L_V0-CONTRAST
  Bottom 0.254: 2+16X2.P$5 11.94,5.33 RLEDPOT.P$2
M_BLANK  (via drill 0.3)
  Top 0.254: v40.51,15.88 41.27,15.88 43.69,13.46 44.45,13.46 LD1.18 | v65.91,13.84 77.22,13.84 77.85,14.48 79.63,14.48 80.64,13.46 LD3.18
  Route2 0.254: v40.51,15.88 42.04,15.88 44.96,12.95 47.88,12.95 48.13,12.7 64.77,12.7 v65.91,13.84
  Bottom 0.254: v40.51,15.88 40.39,15.75 40.39,14.61 M2560.86 | v65.91,13.84 65.91,13.34 65.41,12.83 LD2.18
M_DATA  (via drill 0.3)
  Top 0.254: v40.64,9.91 41.4,10.67 LD1.23
  Bottom 0.254: v40.64,9.91 39.88,9.91 38.86,10.92 M2560.89
M_ERR_RD  (via drill 0.3)
  Top 0.254: v65.02,13.84 65.66,13.21 78.61,13.21 79.12,12.7 79.88,12.7 LD3.19
  Route15 0.254: v65.02,13.84 63.88,12.7 47.62,12.7 43.81,16.51 v41.27,16.51
  Bottom 0.254: v41.27,16.51 41.15,16.38 41.15,15.62 40.89,15.37 40.89,14.61 M2560.85
M_MISO  (via drill 0.3)
  Top 0.203: v35.31,27.18 35.81,27.69 43.43,27.69 45.21,27.18 46.74,27.18 47.75,27.69 49.53,27.69 51.18,26.04 v52.7,26.04 | v95.25,30.23 98.55,26.92 v98.55,25.91
  Bottom 0.203: 31.75,26.67 34.8,26.67 v35.31,27.18 | v95.25,30.23 91.95,33.78 56.13,33.78 55.12,32.51 54.36,32.51 49.02,27.18 49.02,25.02 50.16,23.88 50.55,23.88 v52.7,26.04 52.92,26.25 3.3V-5V-LLS.17 | v98.55,25.91 98.55,24.64 101.85,21.34 101.85,19.05 101.35,18.54 100.58,18.54 M2515.17
  Bottom 0.254: ISP1.1 24.89,29.72 25.91,29.72 28.96,26.67 31.75,26.67 M2560.22
M_MOSI  (via drill 0.3)
  Top 0.203: v45.21,25.65 45.97,25.65 46.35,25.27 v49.91,25.27 | v95.25,29.46 95.5,29.46 97.79,27.18 v97.79,26.92 | v31.75,30.86 35.05,30.86 36.96,32.77 41.53,32.77 v45.72,28.57
  Bottom 0.203: 3.3V-5V-LLS.19 55.5,27.05 51.69,27.05 | 51.69,27.05 v49.91,25.27 | M2560.21 31.75,26.16 36.07,26.16 36.58,25.65 v45.21,25.65 45.72,26.16 v45.72,28.57 | v95.25,29.46 94.49,30.23 94.49,30.48 91.69,33.4 56.39,33.4 55.12,32 54.36,32 51.69,29.08 51.69,27.05 | v97.79,26.92 98.3,26.92 102.36,22.86 102.36,19.05 101.09,17.78 100.58,17.78 M2515.16 | ISP1.4 28.7,30.99 31.75,30.99 v31.75,30.86
M_RST  (via drill 0.3)
  Top 0.254: v95.38,18.92 88.27,18.92 81.53,25.65 74.8,25.65 71.12,29.34 62.99,29.34 60.45,31.88 51.56,31.88 49.91,33.53 33.53,33.53 ISP1.5 28.57,28.57 v23.5,28.57
  Bottom 0.254: 22.61,28.57 22.61,28.96 RST1.P$4 22.61,28.57 | 22.61,28.57 22.61,28.19 20.07,28.19 19.81,28.45 19.05,28.45 RR1.P$2 | v95.38,18.92 96.01,19.81 100.46,19.81 M2515.19 | ISP1.5 29.84,28.83 35.18,28.83 35.31,28.96 35.31,29.84 M2560.30 | v23.5,28.57 22.61,28.57
M_SCK  (via drill 0.3)
  Top 0.203: v45.21,24.89 46.23,24.89 46.48,24.64 v50.55,24.64
  Bottom 0.203: 31.75,25.65 36.07,25.65 36.58,25.15 44.96,25.15 v45.21,24.89 | v50.55,24.64 52.45,26.67 55.61,26.65 3.3V-5V-LLS.18 56.39,26.67 56.9,26.67 57.15,26.92 57.15,32.51 57.66,33.02 76.2,33.02 77.47,32 77.72,32 79.25,33.02 87.12,33.02 90.17,29.46 90.17,22.1 95.76,16.51 100.33,16.51 M2515.14
  Bottom 0.254: ISP1.3 26.92,29.46 25.4,30.99 24.38,30.99 23.37,29.97 23.37,29.72 24.38,28.7 26.16,28.7 29.21,25.65 31.75,25.65 M2560.20
M_SCLK  (via drill 0.3)
  Top 0.254: v42.04,9.91 42.42,10.16 43.71,10.16 LD1.24 | LD3.24 79.88,10.16 79.88,9.78 78.99,8.89 v68.58,8.89 66.93,8.89 64.64,11.18 54.74,11.18 54.1,10.54 v49.66,10.54
  Route2 0.254: v42.04,9.91 43.31,11.18 48.13,11.18 48.77,10.54 v49.66,10.54
  Bottom 0.254: v42.04,9.91 41.4,10.67 39.88,10.67 39.37,11.18 M2560.88 | v68.58,8.89 68.58,9.53 66.17,9.53 LD2.24
M_XLAT  (via drill 0.3)
  Top 0.254: v43.69,9.14 44.17,9.14 44.25,9.22 | 44.25,9.22 LD1.1 | LD3.1 80.64,9.4 79.5,8.26 v66.8,8.26 64.52,10.54 v54.99,10.54 | v44.32,6.48 44.32,9.14 44.25,9.22
  Bottom 0.254: v43.69,9.14 41.66,11.18 40.13,11.18 39.88,11.43 M2560.87 | v66.8,8.26 66.8,8.76 65.41,8.76 LD2.1 | v44.32,6.48 48.39,10.54 48.39,11.43 48.77,11.81 54.99,11.81 v54.99,10.54
N$1
  Top 0.254: LED2.P$4 20.32,22.61 18.03,22.61 16,20.57 13.97,20.57 LED1.P$2
N$2
  Top 0.254: LED3.P$4 31.75,26.42 28.19,26.42 27.43,25.65 25.4,25.65 LED2.P$2
N$3
  Top 0.254: LED4.P$4 43.18,29.46 36.83,29.46 LED3.P$2
N$4
  Top 0.254: LED5.P$4 54.61,30.23 52.58,30.23 50.04,32.77 48.26,32.77 LED4.P$2
N$5
  Top 0.254: LED6.P$4 66.04,30.23 64.52,30.23 61.47,33.27 59.69,33.27 LED5.P$2
N$6
  Top 0.254: LED7.P$4 77.47,29.46 76.45,29.46 72.64,33.27 71.12,33.27 LED6.P$2
N$7
  Top 0.254: LED8.P$4 88.9,26.42 88.9,26.92 83.06,32.77 82.55,32.77 LED7.P$2
N$8
  Top 0.254: RPWR.P$1 5.71,13.34 5.71,13.97 5.08,14.61 5.08,15.24 PWR.ANODE
N$9
  Top 0.254: LED9.P$4 100.33,22.61 100.33,23.11 94.23,29.21 94.23,29.46 93.98,29.72 LED8.P$2
N$10
  Bottom 0.254: CC2.P$2 CC4.P$1
N$11
  Top 0.254: LED10.P$4 111.76,17.53 111.76,18.03 107.7,22.1 107.7,23.88 105.92,25.65 105.41,25.65 LED9.P$2
N$12
  Top 0.254: LED10.P$2 116.84,20.57 117.6,20.57 117.86,20.32 117.86,16.76 116.84,15.75 116.84,14.48 LED11.P$4
N$13
  Top 0.254: LED12.P$4 105.41,19.3 105.41,18.8 109.47,14.73 109.47,12.95 111.25,11.18 111.76,11.18 LED11.P$2
N$14
  Top 0.254: LED13.P$4 93.98,23.11 93.98,22.61 100.08,16.51 100.08,16.26 100.33,16 LED12.P$2
N$15
  Top 0.254: LED14.P$4 82.55,26.16 88.9,19.81 LED13.P$2
N$16
  Top 0.254: LED15.P$4 71.12,26.92 72.9,26.92 76.71,23.11 77.47,23.11 LED14.P$2
N$17
  Top 0.254: LED16.P$4 59.69,26.92 61.21,26.92 64.26,23.88 66.04,23.88 LED15.P$2
N$18
  Top 0.254: LED17.P$4 48.26,26.42 50.29,26.42 52.83,23.88 54.61,23.88 LED16.P$2
N$19
  Top 0.254: LED18.P$4 36.83,23.11 43.18,23.11 LED17.P$2
N$20
  Top 0.254: LED19.P$4 25.4,19.3 28.96,19.3 29.72,20.07 31.75,20.07 LED18.P$2
N$21
  Top 0.305: RPA.P$2 1.91,17.53 1.91,19.18 ACT2.ANODE
N$22
  Top 0.254: LED20.P$4 13.97,14.22 16.26,14.22 18.29,16.26 20.32,16.26 LED19.P$2
N$23
  Bottom 0.254: 16MHZ_M2560.3 36.07,32 36.07,31.75 36.83,30.99 36.83,29.97 M2560.33
N$24
  Bottom 0.254: CC3.P$1 CC1.P$2
N$25
  Bottom 0.254: M2551.8 116.66,15.46 R7.P$1
N$26
  Bottom 0.254: M2560.98 34.37,13.43 CM5.P$2
N$27
  Bottom 0.254: 16MHZCAN.1 108.46,16.51 107.44,16.51 106.93,16 106.43,16 M2515.8
N$28
  Bottom 0.254: 16MHZCAN.3 108.46,14.73 107.19,14.73 106.68,15.24 106.43,15.24 M2515.9
N$29
  Bottom 0.254: 16MHZ_M2560.1 38.1,32 38.1,31.75 37.34,30.99 37.34,29.97 M2560.34
N$31
  Bottom 0.254: CPR1.P$2 16.51,31.88 15.11,33.27 RST2.P$3
N$32
  Top 0.254: RMA.P$1 1.91,22.61 1.91,20.95 ACT1.ANODE
N$33
  Bottom 0.254: CMR1.P$2 19.05,31.88 22.1,31.88 22.1,32.64 22.61,33.15 RST1.P$3
N$34
  Bottom 0.254: BNO.P26 28.96,7.87 28.96,9.65 28.19,10.41 BOSCHILLATOR.P$1 27.94,10.41 27.94,11.18 27.18,11.94 CB4.P$1
N$35
  Bottom 0.254: BNO.P27 29.46,7.87 29.46,9.65 30.23,10.41 BOSCHILLATOR.P$2 30.48,10.41 30.48,11.68 29.46,12.7 CB3.P$1
N$38  (via drill 0.3)
  Top 0.254: RMA.P$2 3.3,22.61 5.97,25.27 5.97,26.67 8,28.7 19.56,28.7 24.38,33.53 30.23,33.53 31.11,32.64 v31.11,32.51
  Bottom 0.254: v31.11,32.51 33.27,30.35 33.27,29.84 M2560.26
N$39
  Bottom 0.254: RCAN1.P$2 120.69,18.08 120.9,18.29 121.71,18.29 RCAN2.P$1
N$41  (via drill 0.3)
  Top 0.254: v115.7,30.61 CHECK_ENGINE.ANODE
  Bottom 0.254: ILINR1.P$2 118.62,30.35 117.35,30.35 ILINR2.P$1 117.35,30.61 v115.7,30.61
N$42
  Bottom 0.254: CC1.P$1 119.34,15.66 RCAN3.P$2
N$43
  Bottom 0.254: RCAN4.P$2 CC2.P$1
N$44
  Top 0.254: RN1.P$1 5.84,18.29 5.84,17.27 RN2.P$1
N$45
  Top 0.254: LD1.20 43.18,12.19 42.04,13.34 RL1.P$2
N$46  (via drill 0.3)
  Top 0.254: v52.2,23.62 51.94,23.88 47.37,23.88 39.88,16.38 39.88,15.62 40.51,14.99 41.53,14.99 42.67,13.84 42.67,13.72 43.69,12.7 LD1.19
  Bottom 0.254: v52.2,23.62 55.5,23.62 56.26,22.86 63.88,22.86 63.88,23.11 64.26,23.5 65.66,23.5 65.66,14.99 67.69,12.95 67.69,10.79 66.93,10.03 LD2.23
N$47
  Top 0.254: LD3.2 81.15,8.89 79.88,7.62 71.12,7.62 68.71,5.21 68.71,2.29 L3.P$1
N$48  (via drill 0.3)
  Top 0.254: v67.06,11.81 65.79,11.81 62.61,14.99 v60.83,14.99
  Bottom 0.254: LD2.20 66.67,11.56 66.93,11.81 v67.06,11.81 | v60.83,14.99 60.45,15.37 60.45,15.88 RL2.P$2
N$49  (via drill 0.3)
  Top 0.254: v66.8,12.57 74.68,12.57 77.98,9.27 78.74,9.27 79.25,9.78 79.25,10.54 79.38,10.67 LD3.23
  Bottom 0.254: v66.8,12.57 66.67,12.57 66.17,12.06 LD2.19
N$50
  Top 0.254: RL3.P$2 78.47,12.33 78.61,12.19 LD3.20
N$51
  Top 0.254: LD3.3 81.66,8.76 80.14,7.24 73.41,7.24 71.75,5.59 71.63,5.59 70.74,4.7 70.74,2.41 70.61,2.29 L3.P$2
N$52
  Top 0.254: LD3.4 82.17,8.38 79.76,5.97 74.04,5.97 73.41,5.33 73.41,3.3 72.39,2.29 L3.P$3
N$53
  Top 0.254: LD3.5 82.68,8.26 80.01,5.59 74.3,5.59 74.04,5.33 74.04,2.41 74.17,2.29 L3.P$4
N$54
  Top 0.254: LD3.6 83.19,9.4 83.19,8.13 78.99,3.94 77.85,3.94 76.2,2.29 L3.P$5
N$55  (via drill 0.3)
  Top 0.254: v78.36,3.3 78.99,3.3 83.82,8.13 83.82,10.16 LD3.7 | v76.71,4.57 75.06,4.57 L3.P$6
  Bottom 0.254: v78.36,3.3 76.71,3.3 v76.71,4.57
N$56  (via drill 0.3)
  Top 0.254: LD3.8 84.45,10.67 84.58,10.54 v84.58,9.65 | v79.25,6.6 74.04,6.6 72.39,4.95 L3.P$7
  Bottom 0.254: v84.58,9.65 79.25,9.65 v79.25,6.6
N$57
  Top 0.254: LD3.9 84.58,11.18 85.22,10.54 85.22,8.89 76.96,0.64 69.85,0.64 69.6,0.89 69.6,4.45 69.72,4.57 L3.P$8
N$58  (via drill 0.3)
  Top 0.254: LD3.10 84.58,11.68 85.22,12.32 85.22,13.72 78.74,20.19 v78.36,20.19 | v70.74,17.78 69.85,18.67 L3.P$9
  Bottom 0.254: v78.36,20.19 70.74,20.19 v70.74,17.78
N$59  (via drill 0.3)
  Top 0.254: LD3.11 84.45,12.19 84.58,12.32 v84.58,13.46 | v78.99,17.14 73.91,17.14 72.39,18.67 L3.P$10
  Bottom 0.254: v84.58,13.46 84.45,13.59 84.45,13.72 81.03,17.14 v78.99,17.14
N$60  (via drill 0.3)
  Top 0.254: v83.82,13.46 83.82,12.7 LD3.12 | v77.85,18.67 75.06,18.67 L3.P$11
  Bottom 0.254: v83.82,13.46 83.19,13.46 80.14,16.51 77.85,16.51 v77.85,18.67
N$61
  Top 0.254: LD3.13 83.19,13.46 83.19,14.48 76.58,21.08 76.2,21.08 L3.P$12
N$62
  Top 0.254: LD3.14 82.68,14.35 79.25,17.78 74.3,17.78 74.04,18.03 74.04,20.95 74.17,21.08 L3.P$13
N$63
  Top 0.254: LD3.15 82.17,13.97 79.63,16.51 72.9,16.51 70.74,18.67 70.74,20.95 70.61,21.08 L3.P$15
N$64
  Top 0.254: LD3.16 81.66,13.84 79.63,15.88 70.99,15.88 68.71,18.16 68.71,21.08 L3.P$16
N$65  (via drill 0.3)
  Top 0.254: v65.02,7.87 64.01,7.87 62.36,9.53 61.85,9.53 59.18,6.86 59.18,2.29 L2.P$1
  Bottom 0.254: LD2.2 64.9,8 v65.02,7.87
N$66  (via drill 0.3)
  Top 0.254: v61.72,3.94 61.72,2.92 61.09,2.29 L2.P$2
  Route2 0.254: v61.72,3.94 v64.52,6.73
  Bottom 0.254: LD2.3 64.39,6.86 v64.52,6.73
N$67  (via drill 0.3)
  Top 0.254: v64.01,5.21 64.01,3.68 62.87,2.54 L2.P$3
  Bottom 0.254: LD2.4 63.88,5.33 v64.01,5.21
N$68  (via drill 0.3)
  Top 0.254: v63.75,0.64 63.75,1.27 64.64,2.16 L2.P$4
  Bottom 0.254: LD2.5 63.37,1.02 v63.75,0.64
N$69  (via drill 0.3)
  Top 0.254: v65.79,8 65.79,5.97 66.55,5.21 66.55,2.29 L2.P$5
  Route2 0.254: v62.74,6.48 64.77,8.51 65.28,8.51 v65.79,8
  Bottom 0.254: v62.74,6.48 62.74,8.64 62.87,8.76 LD2.6
N$70  (via drill 0.3)
  Top 0.254: v62.1,8.89 62.1,8 65.41,4.7 L2.P$6
  Bottom 0.254: v62.1,8.89 62.1,9.53 LD2.7
N$71  (via drill 0.3)
  Top 0.254: v61.47,8.26 61.47,6.1 62.87,4.7 L2.P$7
  Bottom 0.254: LD2.8 61.47,10.03 v61.47,8.26
N$72  (via drill 0.3)
  Top 0.254: v60.33,6.6 60.33,4.7 L2.P$8
  Bottom 0.254: LD2.9 60.33,10.54 v60.33,6.6
N$73  (via drill 0.3)
  Top 0.254: v60.58,13.34 60.58,14.35 60.2,14.73 60.2,18.67 L2.P$9
  Bottom 0.254: LD2.10 60.58,11.05 v60.58,13.34
N$74  (via drill 0.3)
  Top 0.254: v61.47,15.62 61.47,17.27 62.87,18.67 L2.P$10
  Bottom 0.254: LD2.11 61.47,11.56 v61.47,15.62
N$75  (via drill 0.3)
  Top 0.254: v62.36,15.62 62.61,15.62 65.41,18.41 65.41,18.67 L2.P$11
  Bottom 0.254: v62.36,15.62 62.36,12.19 62.23,12.06 LD2.12
N$76  (via drill 0.3)
  Top 0.254: v63.25,15.37 63.75,15.37 66.55,18.16 66.55,21.08 L2.P$12
  Bottom 0.254: v63.25,15.37 62.87,14.99 62.87,12.83 LD2.13
N$77  (via drill 0.3)
  Top 0.254: v64.26,18.16 64.26,20.7 64.64,21.08 L2.P$13
  Bottom 0.254: LD2.14 63.37,14.61 64.26,15.49 v64.26,18.16
N$78  (via drill 0.3)
  Top 0.254: v61.72,19.43 61.72,20.45 61.09,21.08 L2.P$15
  Bottom 0.254: LD2.15 63.88,14.48 64.9,15.49 64.9,18.41 63.88,19.43 v61.72,19.43
N$79  (via drill 0.3)
  Top 0.254: v64.52,22.86 63.88,23.5 61.09,23.5 59.18,21.59 59.18,21.21 L2.P$16
  Bottom 0.254: LD2.16 64.39,14.35 65.28,15.24 65.28,22.1 v64.52,22.86
N$80
  Top 0.254: LD1.2 44.96,7.11 49.53,2.54 49.53,2.29 L1.P$1
N$81  (via drill 0.3)
  Top 0.254: LD1.3 45.47,7.62 v45.97,7.11 | v50.42,0.64 50.42,1.14 51.44,2.16 L1.P$2
  Bottom 0.254: v45.97,7.11 50.42,2.67 v50.42,0.64
N$82
  Top 0.254: LD1.4 45.97,8.76 48.51,6.22 50.8,6.22 52.32,4.7 52.32,3.3 53.34,2.29 L1.P$3
N$83  (via drill 0.3)
  Top 0.254: LD1.5 46.48,8.89 48.51,6.86 v50.42,6.86 | v54.48,3.94 54.48,2.92 55.12,2.29 L1.P$4
  Bottom 0.254: v50.42,6.86 53.34,3.94 v54.48,3.94
N$84  (via drill 0.3)
  Top 0.254: v49.66,7.62 47.88,9.4 46.99,9.4 LD1.6 | v57.02,5.33 57.02,2.29 L1.P$5
  Bottom 0.254: v49.66,7.62 57.02,7.62 v57.02,5.33
N$85  (via drill 0.3)
  Top 0.254: v52.32,5.84 48.01,10.16 47.75,10.16 LD1.7 | v54.74,5.59 54.99,5.59 55.88,4.7 L1.P$6
  Bottom 0.254: v52.32,5.84 54.74,5.84 v54.74,5.59
N$86
  Top 0.254: LD1.8 48.39,10.67 53.34,5.71 L1.P$7
N$87  (via drill 0.3)
  Top 0.254: v49.02,11.18 LD1.9 | v49.28,5.59 50.16,4.7 50.67,4.7 L1.P$8
  Bottom 0.254: v49.02,11.18 49.02,5.84 v49.28,5.59
N$88
  Top 0.254: LD1.10 48.39,11.68 49.66,12.95 49.66,17.65 50.67,18.67 L1.P$9
N$89  (via drill 0.3)
  Top 0.254: LD1.11 48.26,12.19 49.02,12.95 49.02,14.48 v48.77,14.73 | v50.93,16.38 53.34,18.8 L1.P$10
  Bottom 0.254: v48.77,14.73 50.93,14.73 v50.93,16.38
N$90  (via drill 0.3)
  Top 0.254: v48.39,13.34 47.75,12.7 LD1.12 | v50.29,13.46 50.67,13.46 55.88,18.67 L1.P$11
  Bottom 0.254: v48.39,13.34 50.29,13.34 v50.29,13.46
N$91  (via drill 0.3)
  Top 0.254: v47.62,14.1 46.99,13.46 LD1.13 | v54.1,15.24 57.02,18.16 57.02,21.08 L1.P$12
  Bottom 0.254: v47.62,14.1 53.85,14.1 53.85,14.99 v54.1,15.24
N$92  (via drill 0.3)
  Top 0.254: LD1.14 46.48,13.97 v46.86,14.35 | v54.48,19.3 54.48,20.45 55.12,21.08 L1.P$13
  Bottom 0.254: v46.86,14.35 51.31,18.8 54.48,18.8 v54.48,19.3
N$93  (via drill 0.3)
  Top 0.254: LD1.15 45.97,14.99 v49.02,18.03 | v51.94,19.43 51.94,20.7 51.56,21.08 L1.P$15
  Route2 0.254: v49.02,18.03 50.55,18.03 v51.94,19.43
N$94
  Top 0.254: LD1.16 45.47,17.02 49.53,21.08 L1.P$16
N$95  (via drill 0.3)
  Top 0.254: v121.92,20.32 121.92,21.28 TERMINATE.2
  Bottom 0.254: RCAN2.P$2 v121.92,20.32
NBOOT-LOAD
  Bottom 0.254: BNO.P4 30.61,5.97 32.51,5.97 32.51,6.73 33.27,7.49 RB4.P$2
NRESET-3.3V
  Bottom 0.254: RB7.P$1 35.81,6.6 | 35.81,6.6 35.81,3.05 28.7,3.05 27.94,3.81 27.94,4.57 BNO.P11 | 35.81,6.6 38.23,6.6 D1.ANODE
P_MISO
  Bottom 0.254: ISP2.1 5.08,29.21 1.78,29.21 1.02,28.45 1.02,23.11 2.03,22.1 3.05,22.1 5.08,20.07 6.35,20.07 6.35,20.24 328P.16
P_MOSI
  Bottom 0.254: ISP2.4 8.13,32.26 7.11,32.26 6.1,31.24 5.59,31.24 4.06,29.72 1.52,29.72 0.51,28.7 0.51,22.86 3.05,20.32 4.06,20.32 4.83,19.56 6.6,19.56 6.86,19.81 6.99,19.99 328P.15
P_PB1  (via drill 0.3)
  Top 0.254: v3.81,17.53 RPA.P$1
  Bottom 0.254: v3.81,17.53 6.99,17.53 6.99,18.92 8,19.94 328P.13
P_RST
  Bottom 0.254: RR2.P$2 16.51,28.57 15.11,28.57 15.11,28.96 RST2.P$4 14.99,29.08 13.59,30.48 10.79,30.48 ISP2.5 10.79,28.96 8.51,26.67 328P.29
P_SCK
  Bottom 0.254: ISP2.3 6.6,28.19 5.84,28.19 4.83,28.7 2.03,28.7 1.52,28.19 1.52,23.37 2.29,22.61 3.3,22.61 4.83,21.08 5.59,21.08 328P.17
PB7/XTAL2
  Bottom 0.254: 328P.8 10.92,21.08 11.18,20.83 11.18,20.32 12.19,19.3 13.72,19.3 16MHZ_328P.1
PHASE_DND
  Bottom 0.254: SPM1-12V-5V.PHASE$3 SPM1-12V-5V.PHASE$2 SPM1-12V-5V.PHASE$1
PS1-3.3V
  Bottom 0.254: BNO.P5 30.61,5.46 32.89,5.46 32.89,5.84 33.27,6.22 RB3.P$1
PSO-3.3V
  Bottom 0.254: BNO.P6 30.48,4.7 33.27,4.7 33.27,4.95 RB2.P$1
PWRGD  (via drill 0.3)
  Top 0.254: v75.82,14.61 70.1,14.61 67.56,17.14 67.56,23.88 66.55,24.89 63.88,24.89 60.96,27.81 57.15,27.81 v53.98,24.64
  Bottom 0.254: SPM1-12V-5V.PWRGD 109.22,4.06 107.95,4.06 107.95,1.78 107.7,1.52 75.82,1.52 v75.82,14.61 | v53.98,24.64 51.82,24.64 51.82,24.13 50.16,22.48 50.16,18.29 48.13,16.26 46.99,16.26 M2560.75
RTC_INT  (via drill 0.3)
  Top 0.254: v62.61,24.38 60.58,24.38 60.45,24.51 58.8,24.51 58.04,23.75 58.04,17.4 53.98,13.34 v52.7,13.34
  Bottom 0.254: v62.61,24.38 65.53,24.38 66.04,23.88 66.04,23.11 76.71,23.11 84.71,15.11 84.71,14.1 100.97,14.1 103,16.13 103,26.29 102.23,27.05 RTC.3 | v52.7,13.34 50.93,13.34 50.93,13.21 50.42,12.7 47.12,12.7 47.12,13.21 45.97,14.35 45.97,20.45 46.23,20.7 46.99,20.7 M2560.66
RTC_RST  (via drill 0.3)
  Route15 0.254: v66.29,15.24 62.87,18.67 v49.53,18.67
  Bottom 0.254: v66.29,15.24 80.77,15.24 83.19,12.83 96.14,12.83 96.27,12.95 96.27,13.08 100.58,13.08 103.38,15.88 103.38,27.69 101.47,27.69 101.22,27.43 101.22,26.67 RTC.4 | v49.53,18.67 48.01,20.19 46.99,20.19 M2560.67
SCL-3.3V
  Bottom 0.254: 24.38,8.13 RB6.P$1 | 24.38,8.13 25.65,6.86 25.91,6.86 BNO.P19 | 24.38,8.13 24.13,7.87 22.86,7.87 BSS-SCL.P$2
SCL-5V  (via drill 0.3)
  Top 0.254: 2+16X2.P$1 6.86,6.86 6.86,10.67 RSCL.P$1 6.35,11.35 6.35,13.97 5.71,14.61 5.71,15.88 6.35,16.51 6.35,26.42 6.99,27.05 v8,27.05 32.51,27.05 36.58,31.11 v38.61,31.11 | v94.49,31.88 86.61,31.88 84.96,33.53 76.58,33.53 v75.44,32.38
  Route15 0.254: v75.44,32.38 74.8,33.02 55.63,33.02 54.99,32.38 54.36,32.38 v53.47,33.27
  Bottom 0.254: 328P.28 v8,27.05 | 2+16X2.P$1 1.78,0.38 14.61,0.38 15.49,1.27 15.49,3.56 20.83,8.89 BSS-SCL.P$3 | v94.49,31.88 95.89,30.48 95.89,30.1 96.39,29.59 RTC.8 | v53.47,33.27 43.56,33.27 43.43,33.4 41.91,33.4 41.91,31.11 | 41.91,31.11 41.91,29.84 M2560.43 | 41.91,31.11 v38.61,31.11
SD_CS  (via drill 0.3)
  Route15 0.203: v59.18,28.45 67.31,28.45 68.2,27.56 v68.71,27.56
  Bottom 0.203: 3.3V-5V-LLS.1 58.7,27.45 59.18,27.94 v59.18,28.45 | v68.71,27.56 U-SD.2
SD_MISO
  Bottom 0.254: 3.3V-5V-LLS.4 62.83,26.25 63.25,26.67 63.25,27.29 U-SD.7
SD_MOSI
  Bottom 0.254: 3.3V-5V-LLS.2 59.31,27.05 60.2,27.94 60.2,31.5 64.01,31.5 65.28,29.97 65.79,29.97 67.56,28.19 67.56,27.43 U-SD.3
SD_SCK
  Bottom 0.254: U-SD.5 65.53,27.43 65.53,27.94 64.77,28.7 64.01,28.7 63.75,28.45 61.47,28.45 59.69,26.67 58.17,26.67 3.3V-5V-LLS.3
SDA-3.3V
  Bottom 0.254: BNO.P20 25.94,9.07 RB5.P$1 25.91,9.14 25.91,9.65 26.67,10.41 25.91,11.18 23.42,11.18 BSS-SDA.P$2
SDA-5V  (via drill 0.3)
  Top 0.254: 2+16X2.P$2 4.32,3.56 7.37,6.6 7.37,10.16 7.62,10.41 7.62,11.18 7.11,11.68 7.11,11.94 RSDA.P$1 7.62,12.7 7.87,12.95 7.87,14.99 8.89,16 9.91,16 10.16,16.26 10.16,24.64 | 10.16,24.64 10.16,25.4 9.14,26.42 v7.37,26.42 | v94.74,27.81 92.08,27.81 89.79,25.53 84.96,25.53 81.79,28.7 v73.28,28.7 | v61.21,32.38 53.47,32.38 v53.34,32.51 | 10.16,24.64 31.88,24.64 35.81,28.57 v36.96,28.57
  Bottom 0.254: 328P.27 7.49,26.29 v7.37,26.42 | 2+16X2.P$2 4.32,0.76 12.45,0.76 12.95,1.27 12.95,1.78 19.05,7.87 19.05,10.92 20.83,12.7 BSS-SDA.P$3 | RTC.7 94.74,28.32 v94.74,27.81 | v73.28,28.7 69.6,32.38 v61.21,32.38 | v53.34,32.51 43.81,32.51 43.81,32.13 42.42,30.73 42.42,29.84 M2560.44 42.29,29.84 42.29,28.57 v36.96,28.57
VBAT
  Bottom 0.254: CR1216/12MM.PWR@1 93.22,27.18 | 93.22,27.18 96.39,27.18 RTC.6 | CR_DBNC.P$1 94.45,24.93 93.22,26.16 93.22,27.18
WS2812BIN  (via drill 0.3)
  Top 0.254: v7.62,18.54 7.11,18.54 RN1.P$2
  Bottom 0.254: 7.37,18.54 v7.62,18.54 8.38,19.3 | 328P.12 8.51,19.43 8.38,19.3 | M2560.27 33.78,29.97 33.78,30.73 30.99,33.53 24.38,33.53 21.59,30.73 18.29,30.73 17.78,30.23 17.78,27.43 16,25.65 16,18.03 15.75,17.78 9.91,17.78 8.38,19.3
XTAL1
  Bottom 0.254: 16MHZ_328P.3 13.72,21.34 11.94,21.34 11.68,21.59 10.92,21.59 328P.7

## Text on the board
tNames: 8. GND / 7. ILIN / 6. CANL_P / 5. CANH_N / 4. +5V / 3. GND / 2. +12V / 1. GND | Kennesaw State University / Motorsports & EVT / KS-2 - 2017 - v0.2
201bmp: B:/Google Drive/clintonworkspace/Illustrator/logo4-3.bmp